# Altium schematic sheet top.SchDoc
size A4
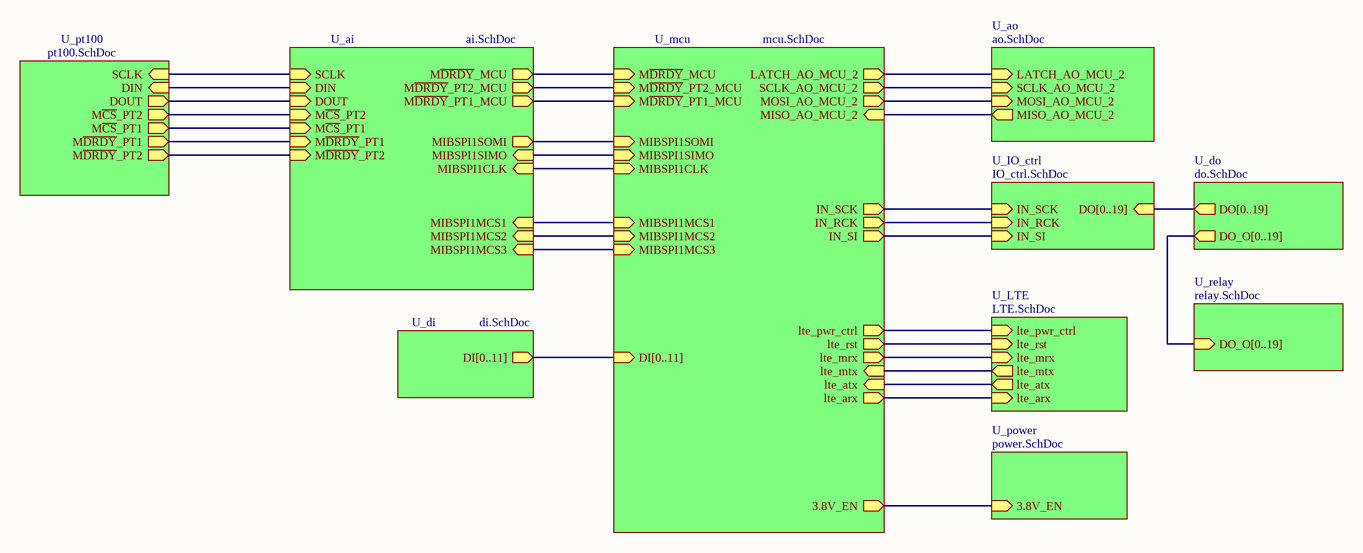
[diagram p0: top.SchDoc]

## Sub-sheets
U_ai = ai.SchDoc: MIBSPI1MCS1 (in), MIBSPI1CLK (in), MIBSPI1SIMO (in), MIBSPI1SOMI (out), M~{DRDY}_PT2_MCU (out), M~{DRDY}_PT1_MCU (out), M~{DRDY}_MCU (out), MIBSPI1MCS2 (in), MIBSPI1MCS3 (in), SCLK (in), DIN (in), DOUT (in), M~{DRDY}_PT1 (in), M~{CS}_PT2 (in), M~{DRDY}_PT2 (in), M~{CS}_PT1 (in)
U_ao = ao.SchDoc: LATCH_AO_MCU_2 (in), SCLK_AO_MCU_2 (in), MOSI_AO_MCU_2 (in), MISO_AO_MCU_2 (out)
U_di = di.SchDoc: DI[0..11] (out)
U_do = do.SchDoc: DO[0..19] (out), DO_O[0..19] (out)
U_IO_ctrl = IO_ctrl.SchDoc: DO[0..19] (in), IN_SI (in), IN_RCK (in), IN_SCK (in)
U_LTE = LTE.SchDoc: lte_pwr_ctrl (in), lte_rst (in), lte_mrx (in), lte_mtx (out), lte_atx (out), lte_arx (in)
U_mcu = mcu.SchDoc: LATCH_AO_MCU_2 (out), SCLK_AO_MCU_2 (out), MOSI_AO_MCU_2 (out), MISO_AO_MCU_2 (in), MIBSPI1MCS1 (in), MIBSPI1CLK (in), MIBSPI1SIMO (in), MIBSPI1SOMI (in), M~{DRDY}_PT2_MCU (in), M~{DRDY}_PT1_MCU (in), M~{DRDY}_MCU (in), MIBSPI1MCS2 (in), MIBSPI1MCS3 (in), DI[0..11] (in), IN_SI (out), IN_RCK (out), IN_SCK (out), lte_pwr_ctrl (out), lte_rst (out), lte_mrx (out), lte_mtx (in), lte_atx (in), lte_arx (out), 3.8V_EN (out)
U_power = power.SchDoc: 3.8V_EN (in)
U_pt100 = pt100.SchDoc: SCLK (in), DIN (in), DOUT (out), M~{DRDY}_PT1 (out), M~{CS}_PT2 (out), M~{DRDY}_PT2 (out), M~{CS}_PT1 (out)
U_relay = relay.SchDoc: DO_O[0..19] (in)

## Nets
(unnamed): sheet U_ao/LATCH_AO_MCU_2, sheet U_mcu/LATCH_AO_MCU_2
(unnamed): sheet U_ao/SCLK_AO_MCU_2, sheet U_mcu/SCLK_AO_MCU_2
(unnamed): sheet U_ao/MOSI_AO_MCU_2, sheet U_mcu/MOSI_AO_MCU_2
(unnamed): sheet U_ao/MISO_AO_MCU_2, sheet U_mcu/MISO_AO_MCU_2
(unnamed): sheet U_IO_ctrl/IN_SI, sheet U_mcu/IN_SI
(unnamed): sheet U_IO_ctrl/IN_RCK, sheet U_mcu/IN_RCK
(unnamed): sheet U_IO_ctrl/IN_SCK, sheet U_mcu/IN_SCK
(unnamed): sheet U_ai/MIBSPI1MCS1, sheet U_mcu/MIBSPI1MCS1
(unnamed): sheet U_ai/MIBSPI1CLK, sheet U_mcu/MIBSPI1CLK
(unnamed): sheet U_ai/MIBSPI1SIMO, sheet U_mcu/MIBSPI1SIMO
(unnamed): sheet U_ai/MIBSPI1SOMI, sheet U_mcu/MIBSPI1SOMI
(unnamed): sheet U_ai/M~{DRDY}_PT2_MCU, sheet U_mcu/M~{DRDY}_PT2_MCU
(unnamed): sheet U_ai/M~{DRDY}_PT1_MCU, sheet U_mcu/M~{DRDY}_PT1_MCU
(unnamed): sheet U_ai/M~{DRDY}_MCU, sheet U_mcu/M~{DRDY}_MCU
(unnamed): sheet U_ai/MIBSPI1MCS2, sheet U_mcu/MIBSPI1MCS2
(unnamed): sheet U_ai/MIBSPI1MCS3, sheet U_mcu/MIBSPI1MCS3
(unnamed): sheet U_ai/SCLK, sheet U_pt100/SCLK
(unnamed): sheet U_ai/DIN, sheet U_pt100/DIN
(unnamed): sheet U_ai/DOUT, sheet U_pt100/DOUT
(unnamed): sheet U_ai/M~{DRDY}_PT1, sheet U_pt100/M~{DRDY}_PT1
(unnamed): sheet U_ai/M~{CS}_PT2, sheet U_pt100/M~{CS}_PT2
(unnamed): sheet U_ai/M~{DRDY}_PT2, sheet U_pt100/M~{DRDY}_PT2
(unnamed): sheet U_ai/M~{CS}_PT1, sheet U_pt100/M~{CS}_PT1
(unnamed): sheet U_power/3.8V_EN, sheet U_mcu/3.8V_EN
(unnamed): sheet U_mcu/lte_pwr_ctrl, sheet U_LTE/lte_pwr_ctrl
(unnamed): sheet U_mcu/lte_rst, sheet U_LTE/lte_rst
(unnamed): sheet U_mcu/lte_mrx, sheet U_LTE/lte_mrx
(unnamed): sheet U_mcu/lte_mtx, sheet U_LTE/lte_mtx
(unnamed): sheet U_mcu/lte_atx, sheet U_LTE/lte_atx
(unnamed): sheet U_mcu/lte_arx, sheet U_LTE/lte_arx

## Buses and harness runs
bus sheet U_di/DI[0..11] = sheet U_mcu/DI[0..11]
bus sheet U_do/DO[0..19] = sheet U_IO_ctrl/DO[0..19]
bus sheet U_do/DO_O[0..19] = sheet U_relay/DO_O[0..19]